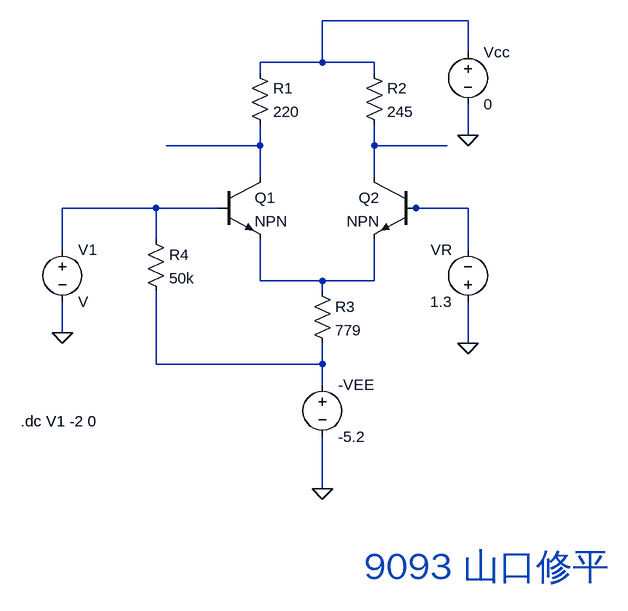
[diagram p0: schematic Draft12.asc]
Draft12.asc, the LTspice schematic file:
Version 4
SHEET 1 880 916
WIRE 624 48 400 48
WIRE 624 96 624 48
WIRE 400 112 400 48
WIRE 400 112 304 112
WIRE 480 112 400 112
WIRE 304 128 304 112
WIRE 480 128 480 112
WIRE 624 224 624 176
WIRE 304 240 304 208
WIRE 304 240 160 240
WIRE 480 240 480 208
WIRE 592 240 480 240
WIRE 304 288 304 240
WIRE 480 288 480 240
WIRE 144 336 0 336
WIRE 240 336 144 336
WIRE 544 336 528 336
WIRE 624 336 544 336
WIRE 144 384 144 336
WIRE 0 400 0 336
WIRE 624 400 624 336
WIRE 304 448 304 384
WIRE 400 448 304 448
WIRE 480 448 480 384
WIRE 480 448 400 448
WIRE 400 464 400 448
WIRE 0 528 0 480
WIRE 624 544 624 480
WIRE 144 576 144 464
WIRE 400 576 400 544
WIRE 400 576 144 576
WIRE 400 608 400 576
WIRE 400 768 400 688
FLAG 0 528 0
FLAG 624 224 0
FLAG 400 768 0
FLAG 624 544 0
SYMBOL npn 240 288 R0
SYMATTR InstName Q1
SYMBOL npn 544 288 M0
SYMATTR InstName Q2
SYMBOL voltage 0 384 R0
SYMATTR InstName V1
SYMBOL voltage 624 80 R0
SYMATTR InstName Vcc
SYMATTR Value 0
SYMBOL voltage 400 592 R0
SYMATTR InstName -VEE
SYMATTR Value -5.2
SYMBOL res 288 112 R0
SYMATTR InstName R1
SYMATTR Value 220
SYMBOL res 464 112 R0
SYMATTR InstName R2
SYMATTR Value 245
SYMBOL res 384 448 R0
SYMATTR InstName R3
SYMATTR Value 779
SYMBOL res 128 368 R0
SYMATTR InstName R4
SYMATTR Value 50k
SYMBOL voltage 624 496 R180
WINDOW 0 24 96 Left 2
WINDOW 3 24 16 Left 2
SYMATTR InstName VR
SYMATTR Value 1.3
TEXT -64 664 Left 2 !.dc V1 -2 0
TEXT 464 888 Left 5 ;9093 山口修平

The netlist it stands for:
* Draft12.asc
Q1 N002 N004 N006 0 NPN
Q2 N003 N005 N006 0 NPN
V1 N004 0 V
Vcc N001 0 0
V§-VEE N007 0 -5.2
R1 N001 N002 220
R2 N001 N003 245
R3 N006 N007 779
R4 N004 N007 50k
VR 0 N005 1.3
.model NPN NPN
.model PNP PNP
.lib standard.bjt
.dc V1 -2 0
* 9093 山口修平
.backanno
.end